# Altium schematic sheet PROC091F_AOP_PWR.SchDoc: AOP_POWER
size 431 x 279 mm; Date: Not shown in title block; ApprovedBy: Not shown in title block; CheckedBy: Not shown in title block; Author: Not shown in title block; CompanyName: Not shown in title block; DrawnBy: Antony/Bala; Engineer: Not shown in title block; Organization: Not shown in title block; Address1: Not shown in title block; Address2: Not shown in title block; Address3: Not shown in title block; Address4: Not shown in title block; DocumentNumber: 4; Revision: Use project parameter SCH_Rev; SheetNumber: 4; SheetTotal: 12; PageSetup: Record=PageOptions|CenterHorizontal=True|CenterVertical=True|PrintScale=1.00|XCorrection=1.00|YCorrection=1.00|PrintKind=0|BorderSize=5000000|LeftOffset=0|BottomOffset=0|Orientation=2|PaperLength=1000|PaperWidth=1000|Scale=100|PaperSource=15|PrintQuality=600|MediaType=1|DitherType=10|PaperKind=Letter|PrintScaleMode=1; CurrentTime: Not shown in title block; CurrentDate: Not shown in title block; Time: Not shown in title block; DocumentFullPathAndName: Not shown in title block; DocumentName: Not shown in title block; ModifiedDate: Not shown in title block; ImagePath: Not shown in title block
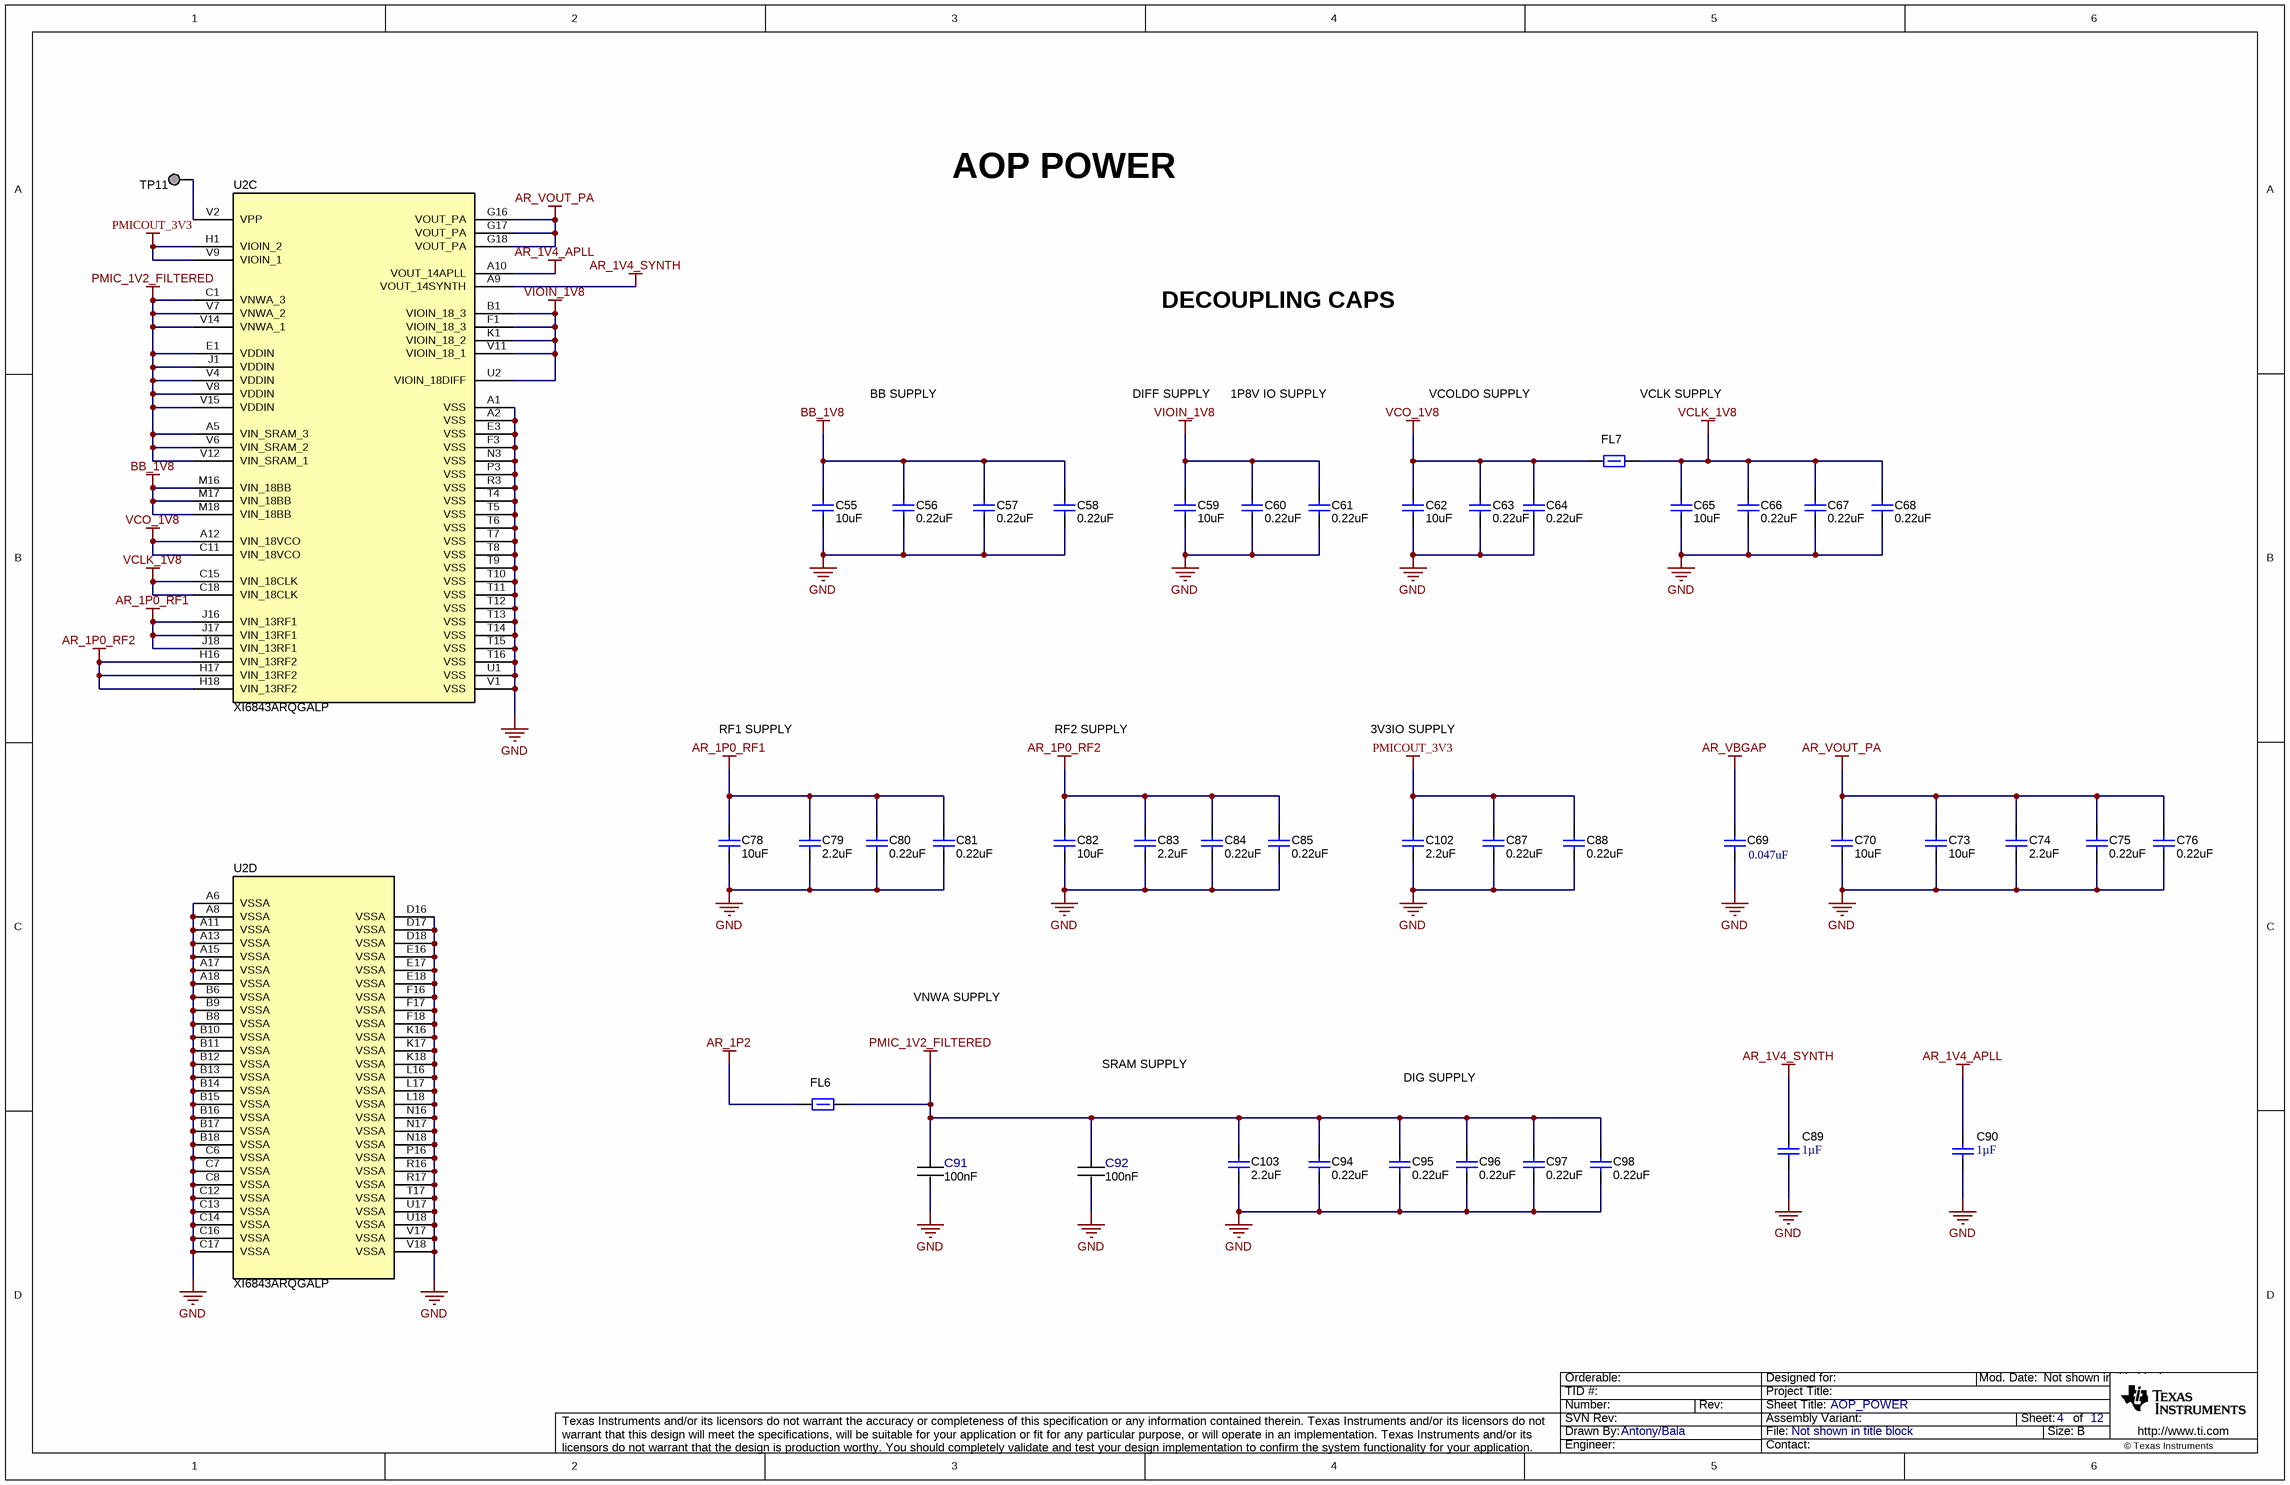
[diagram p0: PROC091F_AOP_PWR.SchDoc]

## Parts
C55  value 10uF  [0402_070]  (hidden comment: CL05A106MP5NUNC)
C56  value 0.22uF  [0201_033L]  (hidden comment: LMK063BJ224MP-F)
C57  value 0.22uF  [0201_033L]  (hidden comment: LMK063BJ224MP-F)
C58  value 0.22uF  [0201_033L]  (hidden comment: LMK063BJ224MP-F)
C59  value 10uF  [0402_070]  (hidden comment: CL05A106MP5NUNC)
C60  value 0.22uF  [0201_033L]  (hidden comment: LMK063BJ224MP-F)
C61  value 0.22uF  [0201_033L]  (hidden comment: LMK063BJ224MP-F)
C62  value 10uF  [0402_070]  (hidden comment: CL05A106MP5NUNC)
C63  value 0.22uF  [0201_033L]  (hidden comment: LMK063BJ224MP-F)
C64  value 0.22uF  [0201_033L]  (hidden comment: LMK063BJ224MP-F)
C65  value 10uF  [0402_070]  (hidden comment: CL05A106MP5NUNC)
C66  value 0.22uF  [0201_033L]  (hidden comment: LMK063BJ224MP-F)
C67  value 0.22uF  [0201_033L]  (hidden comment: LMK063BJ224MP-F)
C68  value 0.22uF  [0201_033L]  (hidden comment: LMK063BJ224MP-F)
C69  ValueDisplayed: 0.047uF  [0201_033L]  (hidden comment: GRM033R61C473KE84D)
C70  value 10uF  [0402_070]  (hidden comment: CL05A106MP5NUNC)
C73  value 10uF  [0402_070]  (hidden comment: CL05A106MP5NUNC)
C74  value 2.2uF  [0201L]  (hidden comment: CL03A225MQ3CRNC)
C75  value 0.22uF  [0201_033L]  (hidden comment: LMK063BJ224MP-F)
C76  value 0.22uF  [0201_033L]  (hidden comment: LMK063BJ224MP-F)
C78  value 10uF  [0402_070]  (hidden comment: CL05A106MP5NUNC)
C79  value 2.2uF  [0201L]  (hidden comment: CL03A225MQ3CRNC)
C80  value 0.22uF  [0201_033L]  (hidden comment: LMK063BJ224MP-F)
C81  value 0.22uF  [0201_033L]  (hidden comment: LMK063BJ224MP-F)
C82  value 10uF  [0402_070]  (hidden comment: CL05A106MP5NUNC)
C83  value 2.2uF  [0201L]  (hidden comment: CL03A225MQ3CRNC)
C84  value 0.22uF  [0201_033L]  (hidden comment: LMK063BJ224MP-F)
C85  value 0.22uF  [0201_033L]  (hidden comment: LMK063BJ224MP-F)
C87  value 0.22uF  [0201_033L]  (hidden comment: LMK063BJ224MP-F)
C88  value 0.22uF  [0201_033L]  (hidden comment: LMK063BJ224MP-F)
C89  ValueDisplayed: 1µF  [0402L]  (hidden comment: CGB2A1X6S0J105K033BC)
C90  ValueDisplayed: 1µF  [0402L]  (hidden comment: CGB2A1X6S0J105K033BC)
C91  Cap_F: 100nF  [FP-GRM033R6YA104KE14D_0201 (0603 Metric)-IPC_C]  (hidden comment: GRM033R6YA104KE14D)
C92  Cap_F: 100nF  [FP-GRM033R6YA104KE14D_0201 (0603 Metric)-IPC_C]  (hidden comment: GRM033R6YA104KE14D)
C94  value 0.22uF  [0201_033L]  (hidden comment: LMK063BJ224MP-F)
C95  value 0.22uF  [0201_033L]  (hidden comment: LMK063BJ224MP-F)
C96  value 0.22uF  [0201_033L]  (hidden comment: LMK063BJ224MP-F)
C97  value 0.22uF  [0201_033L]  (hidden comment: LMK063BJ224MP-F)
C98  value 0.22uF  [0201_033L]  (hidden comment: LMK063BJ224MP-F)
C102  value 2.2uF  [0201L]  (hidden comment: CL03A225MQ3CRNC)
C103  value 2.2uF  [0201L]  (hidden comment: CL03A225MQ3CRNC)
FL6  BLM15PD300SZ1D  [0402L]  (value not drawn)
FL7  BLM15PD300SZ1D  [0402L]  (value not drawn)
TP11  TESTPOINT  [TP_25MIL-SMT]  (value not drawn)  (no BOM)
U2  XI6843ARQGALP  [ALP0180A]  (parts C,D of 4)

## Nets
AR_1P0_RF1: C78.1 C79.1 C80.1 C81.1 U2.J16(VIN_13RF1) U2.J17(VIN_13RF1) U2.J18(VIN_13RF1)
AR_1P0_RF2: C82.1 C83.1 C84.1 C85.1 U2.H16(VIN_13RF2) U2.H17(VIN_13RF2) U2.H18(VIN_13RF2)
AR_1P2: FL6.1
AR_1V4_APLL: C90.1 U2.A10(VOUT_14APLL)
AR_1V4_SYNTH: C89.1 U2.A9(VOUT_14SYNTH)
AR_VBGAP: C69.1
AR_VOUT_PA: C70.1 C73.1 C74.1 C75.1 C76.1 U2.G16(VOUT_PA) U2.G17(VOUT_PA) U2.G18(VOUT_PA)
BB_1V8: C55.1 C56.1 C57.1 C58.1 U2.M16(VIN_18BB) U2.M17(VIN_18BB) U2.M18(VIN_18BB)
GND: C55.2 C56.2 C57.2 C58.2 C59.2 C60.2 C61.2 C62.2 C63.2 C64.2 C65.2 C66.2 C67.2 C68.2 C69.2 C70.2 C73.2 C74.2 C75.2 C76.2 C78.2 C79.2 C80.2 C81.2 C82.2 C83.2 C84.2 C85.2 C87.2 C88.2 C89.2 C90.2 C91.2 C92.2 C94.2 C95.2 C96.2 C97.2 C98.2 C102.2 C103.2 U2.A1(VSS) U2.A2(VSS) U2.A6(VSSA) U2.A8(VSSA) U2.A11(VSSA) U2.A13(VSSA) U2.A15(VSSA) U2.A17(VSSA) U2.A18(VSSA) U2.B6(VSSA) U2.B8(VSSA) U2.B9(VSSA) U2.B10(VSSA) U2.B11(VSSA) U2.B12(VSSA) U2.B13(VSSA) U2.B14(VSSA) U2.B15(VSSA) U2.B16(VSSA) U2.B17(VSSA) U2.B18(VSSA) U2.C6(VSSA) U2.C7(VSSA) U2.C8(VSSA) U2.C12(VSSA) U2.C13(VSSA) U2.C14(VSSA) U2.C16(VSSA) U2.C17(VSSA) U2.D16(VSSA) U2.D17(VSSA) U2.D18(VSSA) U2.E3(VSS) U2.E16(VSSA) U2.E17(VSSA) U2.E18(VSSA) U2.F3(VSS) U2.F16(VSSA) U2.F17(VSSA) U2.F18(VSSA) U2.K16(VSSA) U2.K17(VSSA) U2.K18(VSSA) U2.L16(VSSA) U2.L17(VSSA) U2.L18(VSSA) U2.N3(VSS) U2.N16(VSSA) U2.N17(VSSA) U2.N18(VSSA) U2.P3(VSS) U2.P16(VSSA) U2.R3(VSS) U2.R16(VSSA) U2.R17(VSSA) U2.T4(VSS) U2.T5(VSS) U2.T6(VSS) U2.T7(VSS) U2.T8(VSS) U2.T9(VSS) U2.T10(VSS) U2.T11(VSS) U2.T12(VSS) U2.T13(VSS) U2.T14(VSS) U2.T15(VSS) U2.T16(VSS) U2.T17(VSSA) U2.U1(VSS) U2.U17(VSSA) U2.U18(VSSA) U2.V1(VSS) U2.V17(VSSA) U2.V18(VSSA)
PMIC_1V2_FILTERED: C91.1 C92.1 C94.1 C95.1 C96.1 C97.1 C98.1 C103.1 FL6.2 U2.A5(VIN_SRAM_3) U2.C1(VNWA_3) U2.E1(VDDIN) U2.J1(VDDIN) U2.V4(VDDIN) U2.V6(VIN_SRAM_2) U2.V7(VNWA_2) U2.V8(VDDIN) U2.V12(VIN_SRAM_1) U2.V14(VNWA_1) U2.V15(VDDIN)
PMICOUT_3V3: C87.1 C88.1 C102.1 U2.H1(VIOIN_2) U2.V9(VIOIN_1)
VCLK_1V8: C65.1 C66.1 C67.1 C68.1 FL7.2 U2.C15(VIN_18CLK) U2.C18(VIN_18CLK)
VCO_1V8: C62.1 C63.1 C64.1 FL7.1 U2.A12(VIN_18VCO) U2.C11(VIN_18VCO)
VIOIN_1V8: C59.1 C60.1 C61.1 U2.B1(VIOIN_18_3) U2.F1(VIOIN_18_3) U2.K1(VIOIN_18_2) U2.U2(VIOIN_18DIFF) U2.V11(VIOIN_18_1)
NetTP11_1: TP11.1 U2.V2(VPP)

## Notes on the sheet
- AOP POWER
- DECOUPLING CAPS
- BB SUPPLY
- DIFF SUPPLY
- 1P8V IO SUPPLY
- VCOLDO SUPPLY
- VCLK SUPPLY
- RF1 SUPPLY
- RF2 SUPPLY
- 3V3IO SUPPLY
- VNWA SUPPLY
- SRAM SUPPLY
- DIG SUPPLY
- Drawn By:
- SVN Rev:
- Number:
- TID #:
- Orderable:
- Rev:
- Sheet Title:
- File:
- Project Title:
- Designed for:
- Assembly Variant:
- Mod. Date:
- Sheet:
- Size:
- of
- B
- http://www.ti.com
- Texas Instruments and/or its licensors do not warrant the accuracy or completeness of this specification or any information contained therein. Texas Instruments and/or its licensors do not warrant that this design will meet the specifications, will be suitable for your application or fit for any particular purpose, or will operate in an implementation. Texas Instruments and/or its licensors do not warrant that the design is production worthy. You should completely validate and test your design implementation to confirm the system functionality for your application.
- Engineer:
- Contact:
- © Texas Instruments

## Library data of the parts
C55 C59 C62 C65 C70 C73 C78 C82 = CMP-0006339-4: CAP, CERM, 10 uF, 10 V, +/- 20%, X5R, 0402; Manufacturer: Samsung Electro-Mechanics; AEC Category: Q200; AEC Qualified: N; Cap_Case: 0402; Cap_F: 10µF; SizeArea_mm2: 0.5; SizeAreaWB_mm2: 3; SizeX_mm: 1; SizeZ_mm: 0.6; TaMax_C: 85°C; TaMin_C: -55°C; U/M: EA; Value1: Unknown; Value2: 10V; RoHS: Y; AEC Grade: N/A; ComponentLink1Description: Datasheet link; ComponentLink1URL: http://www.samsungsem.com/kr/support/product-search/mlcc/__icsFiles/afieldfile/2018/06/21/CL05A106MP5NUNC.pdf; CompType: Capacitor; MountType: SMT; PackageReference: 0402; PartNumber: CL05A106MP5NUNC; Polarized: N; SizeY_mm: 0.5; Technology: Ceramic; TempCo: X5R; Tolerance_%: 20%; ValueDisplayed: 10uF; VDC_V: 10V
C56-C58 C60 C61 C63 C64 C66-C68 C75 C76 C80 C81 C84 C85 C87 C88 C94-C98 = CMP-0009781-1: CAP, CERM, 0.22 uF, 10 V, +/- 20%, X5R, 0201; Manufacturer: Taiyo Yuden; AEC Category: Q200; AEC Qualified: N; Cap_Case: 0201; Cap_F: 220nF; SizeArea_mm2: 0.18; SizeAreaWB_mm2: 2.08; SizeX_mm: 0.6; SizeY_mm: 0.3; SizeZ_mm: 0.33; TaMax_C: 85°C; TaMin_C: -55°C; U/M: EA; Value1: Unknown; Value2: 10V; RoHS: Y; AEC Grade: N/A; ComponentLink1Description: Datasheet link; ComponentLink1URL: http://www.yuden.co.jp/productdata/catalog/en/mlcc_all_e.pdf; CompType: Capacitor; LatestRevisionDate: 2017-03-09; MountType: SMT; PackageReference: 0201; PartNumber: LMK063BJ224MP-F; Polarized: N; Published: 2008-06-19; Publisher: Texas Instruments; Supplier 1: Digi-Key; Supplier 2: Newark; Supplier 3: Mouser; Supplier Part Number 1: 587-2483-1-ND; Supplier Part Number 2: 48T3327; Supplier Part Number 3: 963-LMK063BJ224MP-F; Technology: Ceramic; TempCo: X5R; Tolerance_%: 20%; ValueDisplayed: 0.22uF; VDC_V: 10V
C69 = CMP-0009718-2: CAP, CERM, 0.047 uF, 16 V, +/- 10%, X5R, 0201; Manufacturer: MuRata; TaMin_C: -55°C; Polarized: N; SizeAreaWB_mm2: 2.08; Value1: Unknown; U/M: EA; TaMax_C: 85°C; SizeZ_mm: 0.33; SizeX_mm: 0.6; SizeY_mm: 0.3; Cap_Case: 0201; Value2: 16V; SizeArea_mm2: 0.18; Cap_F: 47nF; AEC Category: Q200; Supplier Part Number 2: 81-GRM033R61C473KE4D; Publisher: Texas Instruments; Supplier 2: Mouser; TempCo: X5R; Published: 2008-06-19; RoHS: Y; MountType: SMT; Value: 0.047uF; Supplier 1: Digi-Key; PackageReference: 0201; Tolerance_%: 10%; CompType: Capacitor; LatestRevisionDate: 2017-03-09; PartNumber: GRM033R61C473KE84D; AEC Qualified: N; VDC_V: 16V; ComponentLink1Description: Datasheet link; AEC Grade: N/A; Supplier Part Number 1: 490-7227-1-ND; Technology: Ceramic; ComponentLink1URL: http://search.murata.co.jp/Ceramy/image/img/A01X/G101/ENG/GRM033R61C473KE84-01.pdf
C74 C79 C83 C102 C103 = CMP-0009657-3: CAP, CERM, 2.2 uF, 6.3 V, +/- 20%, X5R, 0201; Manufacturer: Samsung Electro-Mechanics; AEC Category: Q200; Cap_Case: 0201; Cap_F: 2.2µF; Polarized: N; SizeArea_mm2: 0.18; SizeAreaWB_mm2: 2.08; SizeX_mm: 0.6; SizeY_mm: 0.3; SizeZ_mm: 0.26; TaMax_C: 85°C; TaMin_C: -55°C; U/M: EA; Value1: Unknown; Value2: 6.3V; RoHS: Y; AEC Qualified: ?; ComponentLink1Description: Datasheet link; ComponentLink1URL: http://www.samsungsem.com/servlet/FileDownload?type=spec&file=CL03A225MQ3CRNC.pdf; CompType: Capacitor; MountType: SMT; PackageReference: 0201; PartNumber: CL03A225MQ3CRNC; Technology: Ceramic; TempCo: X5R; Tolerance_%: 20%; ValueDisplayed: 2.2uF; VDC_V: 6.3V; LatestRevisionDate: 2017-03-09; Published: 2008-06-19; Publisher: Texas Instruments
C89 C90 = CMP-0081763-1: CAP, CERM, 1 µF, 6.3 V,+/- 10%, X6S, 0402; Manufacturer: TDK; TaMin_C: -55°C; Polarized: N; SizeAreaWB_mm2: 3; U/M: EA; Value: 1uF; TaMax_C: 105°C; SizeZ_mm: 0.6; SizeX_mm: 1; SizeY_mm: 0.5; Cap_Case: 0402; Value2: 6.3V; CompType: Capacitor; AEC Category: Q200; ComponentLink1URL: https://product.tdk.com/info/en/catalog/datasheets/mlcc_commercial_lowprofile_en.pdf; Supplier Part Number 2: 810-CGB2A1X6S0J105KC; Supplier 2: Mouser; TempCo: X6S; RoHS: Y; MountType: SMT; Supplier 1: Digi-Key; PackageReference: 0402; Tolerance_%: 10%; SizeArea_mm2: 0.5; PartNumber: CGB2A1X6S0J105K033BC; AEC Qualified: N; Cap_F: 1µF; VDC_V: 6.3V; ComponentLink1Description: Datasheet link; AEC Grade: N/A; Supplier Part Number 1: 445-13189-1-ND; Technology: Ceramic
C91 C92 = CMP-0086440-1: Cap Ceramic 0.1uF 35V X5R 10% Pad SMD 0201 85C T/R; Manufacturer: Murata Electronics North America; AEC Qualified: No; SizeZ_mm: 0.33mm; Symbol Name: SYM-GRM033R6YA104KE14D; TempCo: 15%; RoHS: TRUE; ComponentLink1Description: Datasheet; ComponentLink1URL: https://search.murata.co.jp/Ceramy/image/img/A01X/G101/ENG/GRM033R6YA104KE14-01.pdf; PackageReference: 0201 (0603 Metric); PartNumber: GRM033R6YA104KE14D; Tolerance_%: 10%; VDC_V: 35V
FL6 FL7 = CMP-0078934-1: Inductor, Ferrite Bead, Ferrite, 2.2 A, 0.035 ohm, AEC-Q200 Grade 1, SMD; Manufacturer: MuRata; AEC Category: Q200; AEC Grade: 1; AEC Qualified: Y; DCR_ohm: 0.035; Imax_A: 2.2A; SizeArea_mm2: 0.5; SizeAreaWB_mm2: 3; SizeZ_mm: 0.6; RoHS: Y; ComponentLink1Description: Datasheet link; ComponentLink1URL: https://www.murata.com/en-us/products/productdata/8796748677150/QNFA9118.pdf; CompType: Inductor; LatestRevisionDate: 2017-12-07; Material: Ferrite; MountType: SMT; PackageReference: 0402; PartNumber: BLM15PD300SZ1D; Published: 2008-06-26; Publisher: Texas Instruments; SizeX_mm: 1; SizeY_mm: 0.5; Supplier 1: Digi-Key; Supplier 2: Mouser; Supplier Part Number 1: 490-16506-1-ND; Supplier Part Number 2: 81-BLM15PD300SZ1D; Technology: Ferrite Bead; Value1: 0.035 ohm; Value2: 2.2A
TP11 = CMP-0078143-3: TEST POINT.  No entry in BOM.; CompType: Testpoint; Manufacturer: N/A; PackageReference: N/A; PartNumber: N/A; Library Reference: TESTPOINT
U2 = CMP-0860942-2: XI6843ARQGALP, ALP0180A (BGA-180); Manufacturer: Texas Instruments; SizeZ_mm: 0.965; SizeX_mm: 15; AEC Qualified: N; SizeArea_mm2: 225; SizeAreaWB_mm2: 289; CompType: IC; AEC Category: Q200; MountType: SMT; ComponentLink2URL: http://www.ti.com/product/xi6843arqg; Alternate Manufacturer: Texas Instruments; ComponentLink2Description: Product Folder; ComponentLink3Description: Online Datasheet; PackageReference: ALP0180A; ComponentLink1URL: http://www.ti.com/lit/ds/symlink/xi6843arqg.pdf; PartNumber: XI6843ARQGALP; PackageDescription: BGA-180; ComponentLink1Description: Datasheet Link; ComponentLink3URL: http://www.ti.com/product/xi6843arqg/datasheet; SizeY_mm: 15